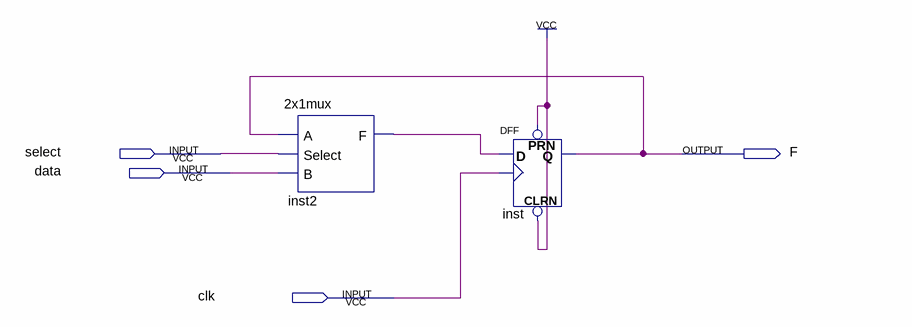
[diagram p0: schematic sheet]
// Quartus schematic onebit.bdf as structural Verilog: 2 symbols, 4 pins
module onebit (
  input  select,
  input  data,
  input  clk,
  output F
);

  wire inst2_f;

  \2x1mux  inst2 (.A(F), .Select(select), .B(data), .F(inst2_f));
  DFF inst (.CLRN(1'b1), .CLK(clk), .D(inst2_f), .PRN(1'b1), .Q(F));
endmodule
